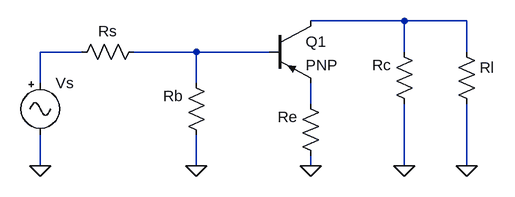
[diagram p0: schematic Draft1.asc]
Draft1.asc, the LTspice schematic file:
Version 4
SHEET 1 880 680
WIRE 464 32 320 32
WIRE 560 32 464 32
WIRE -32 80 -96 80
WIRE 144 80 48 80
WIRE 256 80 144 80
WIRE 464 80 464 32
WIRE 560 80 560 32
WIRE -96 128 -96 80
WIRE 144 128 144 80
WIRE 320 160 320 128
WIRE -96 256 -96 208
WIRE 144 256 144 208
WIRE 320 256 320 240
WIRE 464 256 464 160
WIRE 560 256 560 160
FLAG -96 256 0
FLAG 144 256 0
FLAG 320 256 0
FLAG 464 256 0
FLAG 560 256 0
SYMBOL res 64 64 R90
WINDOW 0 0 56 VBottom 2
WINDOW 3 32 56 VTop 2
SYMATTR InstName Rs
SYMATTR Value ""
SYMBOL res 160 224 R180
WINDOW 0 36 76 Left 2
WINDOW 3 36 40 Left 2
SYMATTR InstName Rb
SYMATTR Value ""
SYMBOL res 336 256 R180
WINDOW 0 36 76 Left 2
WINDOW 3 36 40 Left 2
SYMATTR InstName Re
SYMATTR Value ""
SYMBOL res 480 176 R180
WINDOW 0 36 76 Left 2
WINDOW 3 36 40 Left 2
SYMATTR InstName Rc
SYMATTR Value ""
SYMBOL pnp 256 32 R0
SYMATTR InstName Q1
SYMBOL Misc\\signal -96 112 R0
SYMATTR InstName Vs
SYMATTR Value ""
SYMBOL res 544 64 R0
SYMATTR InstName Rl
SYMATTR Value ""

The netlist it stands for:
* Draft1.asc
Rs N003 N002
Rb 0 N003
Re 0 N004
Rc 0 N001
Q1 N001 N003 N004 0 PNP
Vs N002 0
Rl N001 0
.model NPN NPN
.model PNP PNP
.lib standard.bjt
.backanno
.end